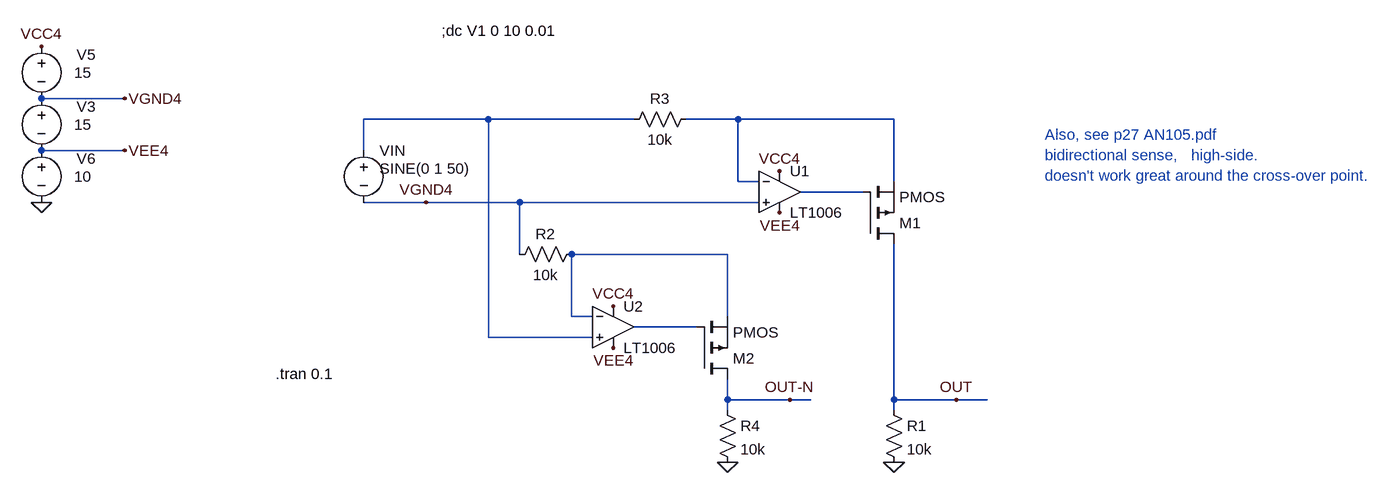
[diagram p0: schematic Draft23.asc]
Draft23.asc, the LTspice schematic file:
Version 4
SHEET 1 2552 760
WIRE -592 -48 -720 -48
WIRE -32 -16 -224 -16
WIRE 192 -16 -32 -16
WIRE 352 -16 272 -16
WIRE 592 -16 352 -16
WIRE -592 32 -720 32
WIRE -224 32 -224 -16
WIRE 352 80 352 -16
WIRE 384 80 352 80
WIRE 592 80 592 -16
WIRE 544 96 448 96
WIRE -128 112 -224 112
WIRE 16 112 -128 112
WIRE 384 112 16 112
WIRE 16 192 16 112
WIRE 336 192 96 192
WIRE 96 288 96 192
WIRE 128 288 96 288
WIRE 336 288 336 192
WIRE 288 304 192 304
WIRE -32 320 -32 -16
WIRE 128 320 -32 320
WIRE 336 416 336 384
WIRE 432 416 336 416
WIRE 464 416 432 416
WIRE 592 416 592 176
WIRE 688 416 592 416
WIRE 736 416 688 416
WIRE 336 432 336 416
WIRE 592 432 592 416
FLAG 688 416 OUT
FLAG -720 -128 VCC4
FLAG -592 -48 VGND4
FLAG -592 32 VEE4
FLAG 416 64 VCC4
FLAG 416 128 VEE4
FLAG -128 112 VGND4
FLAG -720 112 0
FLAG 592 512 0
FLAG 160 272 VCC4
FLAG 160 336 VEE4
FLAG 336 512 0
FLAG 432 416 OUT-N
SYMBOL voltage -224 16 R0
WINDOW 123 0 0 Left 0
WINDOW 39 0 0 Left 0
WINDOW 3 24 44 Left 2
SYMATTR Value SINE(0 1 50)
SYMATTR InstName VIN
SYMBOL res 576 416 R0
SYMATTR InstName R1
SYMATTR Value 10k
SYMBOL OpAmps\\LT1006 416 32 R0
SYMATTR InstName U1
SYMBOL res 288 -32 R90
WINDOW 0 0 56 VBottom 2
WINDOW 3 32 56 VTop 2
SYMATTR InstName R3
SYMATTR Value 10k
SYMBOL pmos 544 176 M180
SYMATTR InstName M1
SYMBOL voltage -720 -64 R0
WINDOW 0 54 29 Left 2
WINDOW 3 50 56 Left 2
WINDOW 123 0 0 Left 0
WINDOW 39 0 0 Left 0
SYMATTR InstName V3
SYMATTR Value 15
SYMBOL voltage -720 -144 R0
WINDOW 0 54 29 Left 2
WINDOW 3 50 56 Left 2
WINDOW 123 0 0 Left 0
WINDOW 39 0 0 Left 0
SYMATTR InstName V5
SYMATTR Value 15
SYMBOL voltage -720 16 R0
WINDOW 0 54 29 Left 2
WINDOW 3 50 56 Left 2
WINDOW 123 0 0 Left 0
WINDOW 39 0 0 Left 0
SYMATTR InstName V6
SYMATTR Value 10
SYMBOL OpAmps\\LT1006 160 240 R0
SYMATTR InstName U2
SYMBOL res 112 176 R90
WINDOW 0 0 56 VBottom 2
WINDOW 3 32 56 VTop 2
SYMATTR InstName R2
SYMATTR Value 10k
SYMBOL pmos 288 384 M180
SYMATTR InstName M2
SYMBOL res 320 416 R0
SYMATTR InstName R4
SYMATTR Value 10k
TEXT -104 -152 Left 2 !;dc V1 0 10 0.01
TEXT -360 376 Left 2 !.tran 0.1
TEXT 824 8 Left 2 ;Also, see p27 AN105.pdf\nbidirectional sense,   high-side.\ndoesn't work great around the cross-over point.

The netlist it stands for:
* Draft23.asc
VIN N001 VGND4 SINE(0 1 50)
R1 OUT 0 10k
XU1 VGND4 N002 VCC4 VEE4 N003 LT1006  ; pins In+ In- V+ V- OUT
R3 N002 N001 10k
M1 OUT N003 N002 N002 PMOS
V3 VGND4 VEE4 15
V5 VCC4 VGND4 15
V6 VEE4 0 10
XU2 N001 N004 VCC4 VEE4 N005 LT1006  ; pins In+ In- V+ V- OUT
R2 N004 VGND4 10k
M2 OUT-N N005 N004 N004 PMOS
R4 OUT-N 0 10k
.model NMOS NMOS
.model PMOS PMOS
.lib standard.mos
;dc V1 0 10 0.01
.tran 0.1
* Also, see p27 AN105.pdf
* bidirectional sense,   high-side.
* doesn't work great around the cross-over point.
.lib LTC.lib
.backanno
.end